# Altium schematic sheet GPS.SchDoc
size A3; DocumentNumber: 2; SheetNumber: 2; SheetTotal: 3
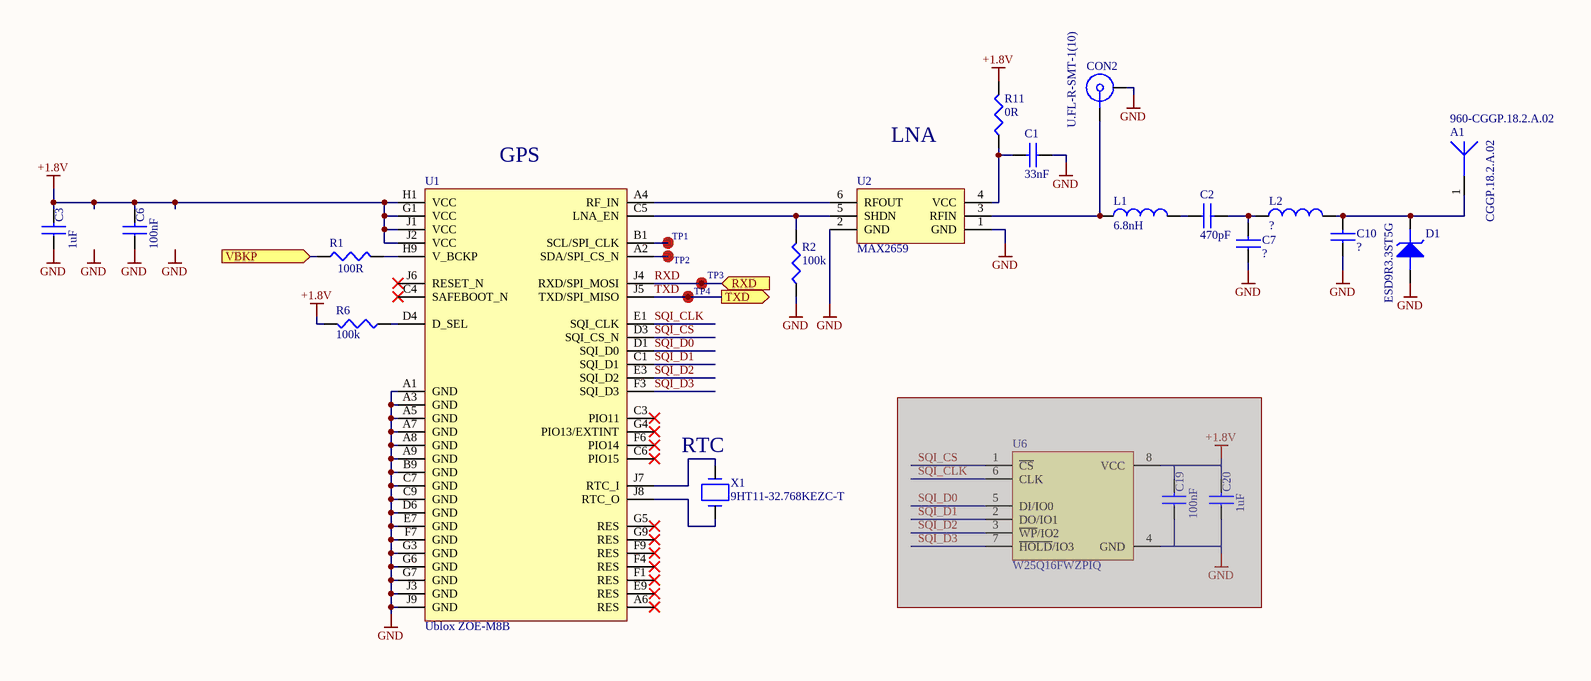
[diagram p0: GPS.SchDoc]

## Parts
A1  CGGP.18.2.A.02  Supplier Part Number 1: 960-CGGP.18.2.A.02  [CGGP.18.2.A.02]
C1  33nF  [CAP0402]
C2  470pF  [CAP0402]
C3  1uF  [CAP0402]
C6  100nF  [CAP0402]
C7  ?  [CAP0402]
C10  ?  [CAP0402]
C19  100nF  [CAP0402]  (masked out: inside a compile mask, not in the netlist)
C20  1uF  [CAP0402]  (masked out: inside a compile mask, not in the netlist)
CON2  U.FL-R-SMT-1(10)  [ufl connector smd]
D1  ESD9R3.3ST5G  [SOD-923]
L1  6.8nH  [IND0402]
L2  ?  [IND0402]
R1  100R  [RES0402]
R2  100k  [RES0402]
R6  100k  [RES0402]
R11  0R  [RES0402]
TP1  TestPoint  [TestPoint:1.2x1.2mm]  (value not drawn)
TP2  TestPoint  [TestPoint:1.2x1.2mm]  (value not drawn)
TP3  TestPoint  [TestPoint:1.2x1.2mm]  (value not drawn)
TP4  TestPoint  [TestPoint:1.2x1.2mm]  (value not drawn)
U1  Ublox ZOE-M8B  [S-LGA51]
U2  MAX2659  [uDFN-6]
U6  W25Q16FWZPIQ  [WSON-8]  (masked out: inside a compile mask, not in the netlist)
X1  9HT11-32.768KEZC-T  [9HT11]

## Ports
RXD (in), TXD (out), VBKP (in)

## Nets
+1.8V: C3.2 C6.2 R6.2 R11.2 U1.G1(VCC) U1.H1(VCC) U1.J1(VCC) U1.J2(VCC)
GND: C1.1 C3.1 C6.1 C7.1 C10.1 CON2.2 D1.A(ANODE) R2.1 U1.A1(GND) U1.A3(GND) U1.A5(GND) U1.A7(GND) U1.A8(GND) U1.A9(GND) U1.B9(GND) U1.C7(GND) U1.C9(GND) U1.D6(GND) U1.E7(GND) U1.F7(GND) U1.G3(GND) U1.G6(GND) U1.G7(GND) U1.J3(GND) U1.J9(GND) U2.1(GND) U2.2(GND)
RXD: TP3.0 U1.J4(RXD/SPI_MOSI) ; port RXD
SQI_CLK: U1.E1(SQI_CLK)
SQI_CS: U1.D3(SQI_CS_N)
SQI_D0: U1.D1(SQI_D0)
SQI_D1: U1.C1(SQI_D1)
SQI_D2: U1.E3(SQI_D2)
SQI_D3: U1.F3(SQI_D3)
TXD: TP4.0 U1.J5(TXD/SPI_MISO) ; port TXD
VBKP: R1.1 ; port VBKP
NetA1_1: A1.1(ANT) C10.2 D1.K(cathode) L2.2
NetC1_2: C1.2 R11.1 U2.4(VCC)
NetC2_1: C2.1 L1.2
NetC2_2: C2.2 C7.2 L2.1
NetCON2_1: CON2.1 L1.1 U2.3(RFIN)
NetR1_2: R1.2 U1.H9(V_BCKP)
NetR2_2: R2.2 U1.C5(LNA_EN) U2.5(SHDN)
NetR6_1: R6.1 U1.D4(D_SEL)
NetTP1_0: TP1.0 U1.B1(SCL/SPI_CLK)
NetTP2_0: TP2.0 U1.A2(SDA/SPI_CS_N)
NetU1_A4: U1.A4(RF_IN) U2.6(RFOUT)
NetU1_J7: U1.J7(RTC_I) X1.2
NetU1_J8: U1.J8(RTC_O) X1.1

Not connected (* = marked no-connect by the designer): U1 A6(RES)* C3(PIO11)* C4(SAFEBOOT_N)* C6(PIO15)* E9(RES)* F1(RES)* F4(RES)* F6(PIO14)* F9(RES)* G4(PIO13/EXTINT)* G5(RES)* G9(RES)* J6(RESET_N)*

## Notes on the sheet
- (near U1) GPS
- LNA
- (near X1) RTC
- Labels drawn without touching a wire or pin: GND
- Size: A3
- Revision:
- Sheet
- of

## Library data of the parts
A1 = ANT - CGGP.18.2.A.02: Antennas Passive GPS/GLONASS Patch Antenna; Manufacturer: Antenova; Manufacturer Part Number: SR42I010-R; Stock 1: 3154; Pricing 1: 1 = 2.36000, 10 = 1.90000, 50 = 1.90000, 100 = 1.52000, 1000 = 1.07000, 10000 = 0.95900 (USD); ComponentLink1Description: Datasheet; ComponentLink1URL: D:\altium\Altium_Library\Passive\Datasheet\CGGP.18.2.A.02.pdf; Supplier 1: Mouser
C1 = C - 33pF/0402: MULTICOMP         MC0402N330J160CT             SMD Multilayer Ceramic Capacitor, 0402 [1005 Metric], 33 pF, 16 V,  5%, C0G / NP0, MC Series                          New; Capacitance: 33pF; Voltage Rating: 16V; Manufacturer: Multicomp; Manufacturer Part Number: MC0402N330J160CT; Stock 1: 19597; Pricing 1: 10=0.011, 100=0.009, 500=0.0069, 2500=0.0041 (EUR); Case Code (Metric): 1005; Case Code (Imperial): 0402; Min Operating Temperature: -55°C; Max Operating Temperature: 125°C; Dielectric: C0G; Packaging: Cut Tape; Tolerance: 5%; Voltage Rating (DC): 16V; REACH SVHC: No SVHC; ComponentLink1URL: http://www.farnell.com/datasheets/2117933.pdf; ComponentLink1Description: http://www.farnell.com/datasheets/2117933.pdf; ComponentLink2URL: http://www.farnell.com/datasheets/2117900.pdf; ComponentLink2Description: http://www.farnell.com/datasheets/2117900.pdf; IRNAS Part No.: /; Supplier 1: Farnell; Supplier Part Number 1: 1759384
C2 = C - 470pF/0402: Manufacturer: Murata; Manufacturer Part Number: GRT155R71H471KE01D; IRNAS Part No.: /; Stock 1: 11080; Pricing 1: 10=0.0259, 100=0.0176, 500=0.0105, 2500=0.008, 5000=0.007, 10000=0.006, 50000=0.0041 (GBP); Supplier 1: Farnell; Supplier Part Number 1: 2672128
C3 C20 = C - 1uF/0402: CAP CER 1UF 10V 20% X5R 0402; Manufacturer: Murata; Manufacturer Part Number: GRM155R61A105ME15D; IRNAS Part No.: /; Stock 1: 0; Pricing 1: 10=0.0379, 100=0.0266, 500=0.0156, 2500=0.0098, 5000=0.0083 (EUR); Mount: Surface Mount; Case/Package: 0402; Case Code (Metric): 1005; Case Code (Imperial): 0402; Min Operating Temperature: -55°C; Max Operating Temperature: 85°C; Capacitance: 1uF; Tolerance: 20%; Voltage Rating: 10V; Packaging: Tape and Reel; Package Quantity: 1; Dielectric: X5R; Voltage: 10V; Voltage Rating (DC): 10V; Length: 1mm; Height: 0.5mm; Width: 0.02inch; Thickness: 0.022inch; Depth: 0.5mm; Radiation Hardening: No; REACH SVHC: No SVHC; Lead Free: Lead Free; ComponentLink1URL: https://datasheet.ciiva.com/164/product-164665.pdf; ComponentLink1Description: https://datasheet.ciiva.com/164/product-164665.pdf; ComponentLink2URL: https://datasheet.ciiva.com/11616/product-11616508.pdf; ComponentLink2Description: https://datasheet.ciiva.com/11616/product-11616508.pdf; ComponentLink3URL: https://datasheet.ciiva.com/46418/1769893-46418047.pdf; ComponentLink3Description: https://datasheet.ciiva.com/46418/1769893-46418047.pdf; ComponentLink4URL: https://datasheet.ciiva.com/164/partnumbering-e-01-164666.pdf; ComponentLink4Description: https://datasheet.ciiva.com/164/partnumbering-e-01-164666.pdf; ComponentLink5URL: https://datasheet.ciiva.com/164/partnumbering-e-01-164667.pdf; ComponentLink5Description: https://datasheet.ciiva.com/164/partnumbering-e-01-164667.pdf; Supplier 1: Farnell
  C3: Supplier Part Number 1: 1740588
  C20: Supplier Part Number 1: 2426953
C6 C19 = C - 100nF/0402: MULTICOMP         MC0402X104J160CT             SMD Multilayer Ceramic Capacitor, 0402 [1005 Metric], 0.1 F, 16 V,  5%, X5R, MC Series                          New; IRNAS Part No.: /; Voltage Rating: 16V; Manufacturer: Multicomp; Manufacturer Part Number: MC0402X104J160CT; Stock 1: 3230; Pricing 1: 10=0.0139, 100=0.0108, 500=0.0076, 2500=0.0051, 5000=0.0038 (EUR); Case Code (Metric): 1005; Case Code (Imperial): 0402; Min Operating Temperature: -55°C; Max Operating Temperature: 85°C; Capacitance: 100nF; Dielectric: X5R; Packaging: Tape and Reel; Tolerance: 5%; Voltage Rating (DC): 16V; REACH SVHC: No SVHC; ComponentLink1URL: http://www.farnell.com/datasheets/2117933.pdf; ComponentLink1Description: http://www.farnell.com/datasheets/2117933.pdf; ComponentLink2URL: http://www.farnell.com/datasheets/2117900.pdf; ComponentLink2Description: http://www.farnell.com/datasheets/2117900.pdf; Supplier 1: Farnell; Supplier Part Number 1: 2627419
C7 C10 = C - 1.8pF/0402: Multilayer Ceramic Capacitors MLCC - SMD/SMT 50volts 1.8pF C0G; Manufacturer: KEMET; Manufacturer Part Number: C0402C189B5GACTU; IRNAS Part No.: /; Voltage Rating: 50V; Supplier 1: Farnell; Stock 1: 8950; Pricing 1: 10=0.463, 100=0.248, 500=0.182, 2500=0.153, 5000=0.134, 10000=0.11, 50000=0.0961 (EUR); Case/Package: 0402; Case Code (Imperial): 0402; Case Code (Metric): 1005; Dielectric Material: Ceramic; Min Operating Temperature: -55°C; Max Operating Temperature: 125°C; Packaging: Tape and Reel; Voltage Rating (DC): 50V; Capacitance: 1.8pF; Termination: SMD/SMT; Lead Free: Lead Free; ComponentLink1URL: https://datasheet.ciiva.com/5413/kem-c1003-c0g-smd-5413366.pdf; ComponentLink1Description: https://datasheet.ciiva.com/5413/kem-c1003-c0g-smd-5413366.pdf; Supplier Part Number 1: 2820847
CON2 = U.FL-R-SMT-1(10): RF / Coaxial Connector, U.FL Coaxial, Straight Jack, Surface Mount Vertical, 50 ohm, Brass; Manufacturer: Hirose; Featured Product: U.FL Series Connectors; Connector Style: U.FL, Ultra Miniature Coaxial; Connector Type: Receptacle, Male Pin; Contact Termination: Solder; Impedance: 50 Ohm; Frequency - Max: 6GHz; Body Material: Phosphor Bronze; Body Finish: Silver; Center Contact Plating: Gold; Dielectric Material: Liquid Crystal Polymer (LCP); Online Catalog: UMCC (Ultra Miniature Coax Connectors), U.FL Series; Other Names: H11891TR  Q5400621  U.FL-R-SMT-1 10  U.FL-R-SMT-1(10)-ND  UFLRSMT110; Manufacturer Part Number: U.FL-R-SMT-1(10); Stock 1: 0; Standard Package: 2,500; Category: Connectors, Interconnects; Family: Coaxial Connectors (RF); Series: U.FL; Packaging: Tape & Reel (TR); Shield Termination: Solder; Mounting Type: Surface Mount; Cable Group: -; Fastening Type: Snap-On; Features: -; Housing Color: Beige; Ingress Protection: -; Center Contact Material: Brass; Voltage Rating: -; Operating Temperature: -40°C ~ 90°C; ComponentLink1URL: http://www.farnell.com/datasheets/91524.pdf; ComponentLink1Description: http://www.farnell.com/datasheets/91524.pdf; ComponentLink2URL: http://uk.rs-online.com/webdocs/1363/0900766b81363563.pdf; ComponentLink2Description: http://uk.rs-online.com/webdocs/1363/0900766b81363563.pdf; ComponentLink3URL: http://www.farnell.com/datasheets/1947917.pdf; ComponentLink3Description: http://www.farnell.com/datasheets/1947917.pdf; Supplier 1: Farnell; Supplier Part Number 1: 1688077
D1 = D_TVS - ESD9R3.3ST5G: TVS Diode, ESD9R Series, Unidirectional, 3.3 V, 7.8 V; Manufacturer: DIODES INC.; Manufacturer Part Number: 1N4148W-7-F.; Diode Configuration: Single; Repetitive Reverse Voltage Vrrm Max: 100; Forward Current If(AV): 300; Forward Voltage VF Max: 1.25; Reverse Recovery Time trr Max: 4; Forward Surge Current Ifsm Max: 2; Diode Case Style: SOD-123; Product Range: 1N4148 Series; SVHC: No SVHC (17-Dec-2015); Diode Type: Switching; RoHS: YES; Stock 1: 157320; Pricing 1: 1=0.136, 25=0.132, 100=0.0465, 500=0.042, 1000=0.024, 3000=0.021, 9000=0.017, 30000=0.0149 (GBP); Operating Temperature Max: 150; No. of Pins: 2; Packaging: Cut Tape; Automotive Qualification Standard: -; MSL: MSL 1 - Unlimited; Operating Temperature Min: -65; Operating Temperature Range: -65°C to +150°C<!--FANDB--><div class="features-and-benefits-container"><div class="features-and-benefits-description"><span class="features-benefits-value">The 1N4148W-7-F is a surface mount fast Switching Diode with moulded plastic case. Suitable for general purpose switching applications.</span></div><div class="features-and-benefits-list"><ul class="features-and-benefits-list-list"><li class="features-and-benefits-list-item">Fast Switching Speed</li><li class="features-and-benefits-list-item">2; ComponentLink1URL: D:\altium\Altium_Library\Active\Datasheet\ESD9R33ST5G.pdf; ComponentLink1Description: Datasheet; Supplier 1: Farnell; Supplier Part Number 1: 2101835
L1 = L - 33nH/0402: FIXED IND 33NH 200MA 580 MOHM; Manufacturer: Murata; Manufacturer Part Number: LQG15HS33NJ02D; IRNAS Part No.: /; Core Material: Air; Tolerance: 5%; Q Factor: 8; Self Resonant Frequency: 1.6GHz; Shielding: Unshielded; DC Resistance (DCR): 580mR; Test Frequency: 100MHz; Stock 1: 168013; Pricing 1: 1=0.1, 10=0.061, 100=0.0404, 500=0.0337, 1000=0.0283, 2500=0.0242 (USD); Mount: Surface Mount; Case/Package: 0402; Case Code (Metric): 1005; Case Code (Imperial): 0402; Min Operating Temperature: -55°C; Max Operating Temperature: 125°C; Package Quantity: 10000; Packaging: Tape and Reel; Current Rating: 200mA; Inductance: 33nh; Max DC Current: 200mA; Termination: SMD/SMT; DC Current: 200mA; Military Standard: Not; Length: 1mm; Height: 0.5mm; Width: 0.5mm; Height - Seated (Max): 0.022inch; Depth: 0.55mm; Radiation Hardening: No; Lead Free: Lead Free; ComponentLink1URL: https://datasheet.ciiva.com/11799/0900766b8090d685-11799024.pdf; ComponentLink1Description: https://datasheet.ciiva.com/11799/0900766b8090d685-11799024.pdf; ComponentLink2URL: https://datasheet.ciiva.com/1038/l0075s0083lqg15hs-1038140.pdf; ComponentLink2Description: https://datasheet.ciiva.com/1038/l0075s0083lqg15hs-1038140.pdf; ComponentLink3URL: https://datasheet.ciiva.com/1038/l0075s0083lqg15hs-1038141.pdf; ComponentLink3Description: https://datasheet.ciiva.com/1038/l0075s0083lqg15hs-1038141.pdf; ComponentLink4URL: https://datasheet.ciiva.com/16207/l0075s0083lqg15hs-16207871.pdf; ComponentLink4Description: https://datasheet.ciiva.com/16207/l0075s0083lqg15hs-16207871.pdf; ComponentLink5URL: https://datasheet.ciiva.com/1038/l0075s0083lqg15hs-1038139.pdf; ComponentLink5Description: https://datasheet.ciiva.com/1038/l0075s0083lqg15hs-1038139.pdf; ComponentLink6URL: https://datasheet.ciiva.com/17279/l0075s0083lqg15hs-17279253.pdf; ComponentLink6Description: https://datasheet.ciiva.com/17279/l0075s0083lqg15hs-17279253.pdf; ComponentLink7URL: https://datasheet.ciiva.com/4977/o05e-4977560.pdf; ComponentLink7Description: https://datasheet.ciiva.com/4977/o05e-4977560.pdf; ComponentLink8URL: https://datasheet.ciiva.com/8510/l0075s0083lqg15hs-8510857.pdf; ComponentLink8Description: https://datasheet.ciiva.com/8510/l0075s0083lqg15hs-8510857.pdf; Supplier 1: Farnell; Supplier Part Number 1: 1711736
L2 = L - 4.3nH/0402: Inductor RF Chip Multi-Layer 4.3nH 0.3nH 100MHz 8Q-Factor Air 300mA 210mOhm DCR 0402 Paper T/R; Manufacturer: Murata; Manufacturer Part Number: LQG15HN4N3S02D; IRNAS Part No.: /; Q Factor: 8; Self Resonant Frequency: 6GHz; Shielding: Unshielded; DC Resistance (DCR): 210mR; Supplier 1: Digi-Key; Stock 1: 3502; Pricing 1: 1 = 0.10000, 10 = 0.06100, 100 = 0.04040, 500 = 0.03366, 1000 = 0.02827, 2500 = 0.02423 (USD); RoHS: Yes; Mount: Surface Mount; Case/Package: 0402; Core Material: Air; Case Code (Metric): 1005; Case Code (Imperial): 0402; Min Operating Temperature: -55°C; Max Operating Temperature: 125°C; Package Quantity: 10000; Packaging: Tape and Reel; Current Rating: 300mA; Inductance: 4.3nh; Test Frequency: 100MHz; Max DC Current: 300mA; Termination: SMD/SMT; Current: 300mA; DC Current: 300mA; Military Standard: Not; Length: 1.05mm; Height: 0.5mm; Width: 0.02inch; Height - Seated (Max): 0.022inch; Depth: 0.55mm; Radiation Hardening: No; REACH SVHC: No SVHC; Lead Free: Lead Free; ComponentLink1URL: http://uk.rs-online.com/webdocs/0f10/0900766b80f10808.pdf?src-supplier=RSComponents; ComponentLink1Description: http://uk.rs-online.com/webdocs/0f10/0900766b80f10808.pdf?src-supplier=RSComponents; ComponentLink2URL: http://search.murata.co.jp/Ceramy/image/img/PDF/ENG/L0075S0083LQG15HN.pdf?src-supplier=Avnet; ComponentLink2Description: http://search.murata.co.jp/Ceramy/image/img/PDF/ENG/L0075S0083LQG15HN.pdf?src-supplier=Avnet; ComponentLink3URL: http://www.farnell.com/datasheets/66026.pdf?src-supplier=Element14; ComponentLink3Description: http://www.farnell.com/datasheets/66026.pdf?src-supplier=Element14; ComponentLink4URL: https://www.verical.com/server-webapp/html/getDatasheet?partID=31252&src-supplier=Verical; ComponentLink4Description: https://www.verical.com/server-webapp/html/getDatasheet?partID=31252&src-supplier=Verical; ComponentLink5URL: http://search.murata.co.jp/Ceramy/image/img/PDF/ENG/L0075S0083LQG15HN.pdf?src-supplier=Avnet+Europe; ComponentLink5Description: http://search.murata.co.jp/Ceramy/image/img/PDF/ENG/L0075S0083LQG15HN.pdf?src-supplier=Avnet+Europe; ComponentLink6URL: https://search.murata.co.jp/Ceramy/image/img/P02/partnumberingAT_LQ3E.pdf?src-supplier=Digi-Key; ComponentLink6Description: https://search.murata.co.jp/Ceramy/image/img/P02/partnumberingAT_LQ3E.pdf?src-supplier=Digi-Key; Supplier Part Number 1: 490-6563-1-ND
R1 = R - 100R/0402: MULTICOMP         MCMR04X1000FTL            SMD Chip Resistor, Ceramic, MCMR Series, 100 ohm, 50 V, 0402 [1005 Metric], 62.5 mW,  1%; IRNAS Part No.: /; Temperature Coefficient: 100ppm/°C; Power Rating: 62.5mW; Voltage Rating: 50V; Supplier 1: Farnell; Manufacturer: Multicomp; Manufacturer Part Number: MCMR04X1000FTL; Stock 1: 62365; Pricing 1: 10=0.0071, 100=0.0042, 500=0.003, 2500=0.0024, 5000=0.0019 (GBP); Case/Package: 0402; Case Code (Metric): 1005; Case Code (Imperial): 0402; Resistance: 100R; Tolerance: 1%; Composition: Ceramic; Packaging: Cut Tape; Voltage Rating (DC): 50V; REACH SVHC: No SVHC; ComponentLink1URL: https://datasheet.ciiva.com/28692/1716705-28692087.pdf; ComponentLink1Description: https://datasheet.ciiva.com/28692/1716705-28692087.pdf; ComponentLink2URL: https://datasheet.ciiva.com/22708/1716705-22708156.pdf; ComponentLink2Description: https://datasheet.ciiva.com/22708/1716705-22708156.pdf; Supplier Part Number 1: 2072515
R2 R6 = R - 100k/0402: MULTICOMP   MCWR04X1003FTL   RES, THICK FILM, 100KOHM, 1%, 0.0625W; IRNAS Part No.: I-100013; Resistance: 100kR; Power Rating: 62.5mW; Voltage Rating: 50V; Temperature Coefficient: 100ppm/°C; Supplier 1: Farnell; Manufacturer: Multicomp; Manufacturer Part Number: MCWR04X1003FTL; Stock 1: 161188; Pricing 1: 10=0.0029, 100=0.0017, 500=0.0012, 2500=0.001, 5000=0.0008 (EUR); Mount: Surface Mount; Case/Package: 0402; Case Code (Metric): 1005; Case Code (Imperial): 0402; Tolerance: 1%; Packaging: Cut Tape; Composition: Thick Film; Voltage Rating (DC): 50V; REACH SVHC: No SVHC; ComponentLink1URL: https://datasheet.ciiva.com/46386/1849611-46386524.pdf; ComponentLink1Description: https://datasheet.ciiva.com/46386/1849611-46386524.pdf; Supplier Part Number 1: 2447094
R11 = R - 0R/0402: RESISTOR, 0402, 0R, ANTI SULFURATION; Manufacturer: Multicomp; Manufacturer Part Number: MCMR04X000PTL; IRNAS Part No.: I-100016; Voltage Rating: 50V; Resistance: 0mR; Power Rating: 62.5mW; Temperature Coefficient: 400ppm/°C; Supplier 1: Farnell; Stock 1: 0; Pricing 1: 10=0.0057, 100=0.0034, 500=0.0024, 2500=0.0019, 5000=0.0015 (EUR); Case/Package: 0402; Case Code (Metric): 1005; Case Code (Imperial): 0402; Packaging: Cut Tape; Composition: Ceramic; Voltage Rating (DC): 50V; REACH SVHC: No SVHC; ComponentLink1URL: https://datasheet.ciiva.com/7776/1716705-7776974.pdf; ComponentLink1Description: https://datasheet.ciiva.com/7776/1716705-7776974.pdf; ComponentLink2URL: https://datasheet.ciiva.com/28677/1716705-28677161.pdf; ComponentLink2Description: https://datasheet.ciiva.com/28677/1716705-28677161.pdf; Supplier Part Number 1: 2072513
TP1-TP4 = TestPoint: TEST POINT ROUND SMD; FIT: 0.94; Komp / Device: SMD; ComponentLink1Description: Datasheet
U1 = RF - UBLOX-ZOE-M8B: ZOE-M8 RF Receiver BeiDou, Galileo, GLONASS, GNSS, GPS -160dBm; Manufacturer: u-blox; Manufacturer Part Number: MAX-M8Q-0; Stock 1: 10805; Supplier 1: Digi-Key; Supplier Part Number 1: 672-1063-1-ND
U2 = RF - MAX2659: RF Amplifier, GPS / GNSS, 20.5 dB Gain / 0.8 dB Noise, 1575.42 MHz, 1.6 V to 3.3 V Supply; Manufacturer: u-blox; Manufacturer Part Number: MAX-M8Q-0; Stock 1: 10805; ComponentLink1Description: Datasheet; ComponentLink1URL: D:\altium\Altium_Library\Active\Datasheet\MAX2659.pdf; Supplier 1: Farnell; Supplier Part Number 1: 2800966; Supplier 2: Mouser; Supplier Part Number 2: 700-MAX2659ELT+T
U6 = MEM - W25Q16FWZPIQ: NOR Flash spiFlash, 1.8V, 16M-bit, 4Kb Uniform Sector; Manufacturer: DIODES INC.; Manufacturer Part Number: 1N4148W-7-F.; Diode Configuration: Single; Repetitive Reverse Voltage Vrrm Max: 100; Forward Current If(AV): 300; Forward Voltage VF Max: 1.25; Reverse Recovery Time trr Max: 4; Forward Surge Current Ifsm Max: 2; Diode Case Style: SOD-123; Product Range: 1N4148 Series; SVHC: No SVHC (17-Dec-2015); Diode Type: Switching; Supplier 1: Farnell; RoHS: YES; Stock 1: 157320; Pricing 1: 1=0.136, 25=0.132, 100=0.0465, 500=0.042, 1000=0.024, 3000=0.021, 9000=0.017, 30000=0.0149 (GBP); Operating Temperature Max: 150; No. of Pins: 2; Packaging: Cut Tape; Automotive Qualification Standard: -; MSL: MSL 1 - Unlimited; Operating Temperature Min: -65; Operating Temperature Range: -65°C to +150°C<!--FANDB--><div class="features-and-benefits-container"><div class="features-and-benefits-description"><span class="features-benefits-value">The 1N4148W-7-F is a surface mount fast Switching Diode with moulded plastic case. Suitable for general purpose switching applications.</span></div><div class="features-and-benefits-list"><ul class="features-and-benefits-list-list"><li class="features-and-benefits-list-item">Fast Switching Speed</li><li class="features-and-benefits-list-item">2; Supplier Part Number 1: 1776392; ComponentLink1Description: DataSheet; ComponentLink1URL: D:\altium\Altium_Library\Active\Datasheet\W25Q16FWZPIQ.pdf
X1 = X - 9HT11-32.768KEZC-T: Crystal, 32.768 kHz, SMD, 2mm x 1.2mm, 9 pF, 10 ppm, 9HT11 Series; Manufacturer: IQD; Manufacturer Part Number: LFXTAL009678; IRNAS Part No.: /; Load Capacitance: 12.5pF; Frequency: 32.8kHz; Stock 1: 15609; Pricing 1: 5=0.283, 50=0.203, 250=0.169, 500=0.163, 1500=0.157, 3000=0.152, 15000=0.146 (EUR); Case/Package: 217; Number of Pins: 2; Min Operating Temperature: -40°C; Max Operating Temperature: 85°C; REACH SVHC: No SVHC; ComponentLink1URL: http://www.farnell.com/datasheets/1750031.pdf?_ga=2.80970644.2249963.1562564392-1373726713.1554121096&_gac=1.50020820.1562763802.CjwKCAjwmZbpBRAGEiwADrmVXm8xT8OHDZvJe8qZIQyyGmIuiUD-TEITatw0hIdDkyBwIXXCH7oneRoCl7cQAvD_BwE; ComponentLink1Description: Datasheet; Supplier 1: Farnell; Supplier Part Number 1: 2819312